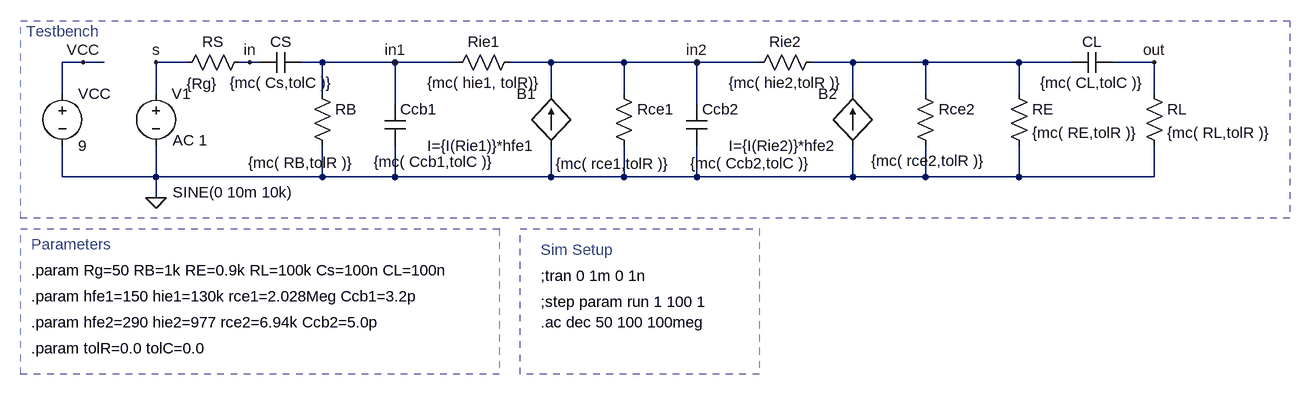
[diagram p0: schematic inc.asc]
inc.asc, the LTspice schematic file:
Version 4
SHEET 1 1348 680
WIRE -512 -224 -544 -224
WIRE -480 -224 -512 -224
WIRE -352 -224 -400 -224
WIRE -256 -224 -272 -224
WIRE -240 -224 -256 -224
WIRE -144 -224 -176 -224
WIRE -32 -224 -144 -224
WIRE 64 -224 -32 -224
WIRE 208 -224 144 -224
WIRE 320 -224 208 -224
WIRE 432 -224 320 -224
WIRE 528 -224 432 -224
WIRE 672 -224 608 -224
WIRE 784 -224 672 -224
WIRE 928 -224 784 -224
WIRE 1008 -224 928 -224
WIRE 1136 -224 1072 -224
WIRE -544 -176 -544 -224
WIRE -400 -176 -400 -224
WIRE -144 -176 -144 -224
WIRE 208 -176 208 -224
WIRE 320 -176 320 -224
WIRE 672 -176 672 -224
WIRE 784 -176 784 -224
WIRE 928 -176 928 -224
WIRE 1136 -176 1136 -224
WIRE -32 -160 -32 -224
WIRE 432 -160 432 -224
WIRE -544 -48 -544 -96
WIRE -400 -48 -400 -96
WIRE -400 -48 -544 -48
WIRE -144 -48 -144 -96
WIRE -144 -48 -400 -48
WIRE -32 -48 -32 -96
WIRE -32 -48 -144 -48
WIRE 208 -48 208 -96
WIRE 208 -48 -32 -48
WIRE 320 -48 320 -96
WIRE 320 -48 208 -48
WIRE 432 -48 432 -96
WIRE 432 -48 320 -48
WIRE 672 -48 672 -96
WIRE 672 -48 432 -48
WIRE 784 -48 784 -96
WIRE 784 -48 672 -48
WIRE 928 -48 928 -96
WIRE 928 -48 784 -48
WIRE 1136 -48 1136 -96
WIRE 1136 -48 928 -48
WIRE -400 -16 -400 -48
FLAG -400 -16 0
FLAG 1136 -224 out
FLAG -256 -224 in
FLAG 432 -224 in2
FLAG -400 -224 s
FLAG -32 -224 in1
FLAG -512 -224 VCC
SYMBOL voltage -400 -192 R0
WINDOW 3 26 168 Left 2
WINDOW 123 26 88 Left 2
WINDOW 39 0 0 Left 0
SYMATTR Value SINE(0 10m 10k)
SYMATTR Value2 AC 1
SYMATTR InstName V1
SYMBOL voltage -544 -192 R0
WINDOW 123 0 0 Left 0
WINDOW 39 0 0 Left 0
SYMATTR InstName VCC
SYMATTR Value 9
SYMBOL res -368 -208 R270
WINDOW 0 32 56 VTop 2
WINDOW 3 -1 39 VBottom 2
SYMATTR InstName RS
SYMATTR Value {Rg}
SYMBOL res -160 -192 R0
WINDOW 3 -98 122 Left 2
SYMATTR Value {mc( RB,tolR )}
SYMATTR InstName RB
SYMBOL res 48 -208 R270
WINDOW 0 32 56 VTop 2
WINDOW 3 0 56 VBottom 2
SYMATTR InstName Rie1
SYMATTR Value {mc( hie1, tolR)}
SYMBOL res 304 -192 R0
WINDOW 3 -89 124 Left 2
SYMATTR Value {mc( rce1,tolR )}
SYMATTR InstName Rce1
SYMBOL cap -240 -208 R270
WINDOW 0 32 32 VTop 2
WINDOW 3 0 32 VBottom 2
SYMATTR InstName CS
SYMATTR Value {mc( Cs,tolC )}
SYMBOL cap -48 -160 R0
WINDOW 3 -17 89 Left 2
SYMATTR Value {mc( Ccb1,tolC )}
SYMATTR InstName Ccb1
SYMBOL res 512 -208 R270
WINDOW 0 32 56 VTop 2
WINDOW 3 0 56 VBottom 2
SYMATTR InstName Rie2
SYMATTR Value {mc( hie2,tolR )}
SYMBOL res 768 -192 R0
WINDOW 3 -68 119 Left 2
SYMATTR Value {mc( rce2,tolR )}
SYMATTR InstName Rce2
SYMBOL cap 416 -160 R0
WINDOW 3 6 91 Left 2
SYMATTR Value {mc( Ccb2,tolC )}
SYMATTR InstName Ccb2
SYMBOL res 912 -192 R0
SYMATTR InstName RE
SYMATTR Value {mc( RE,tolR )}
SYMBOL res 1120 -192 R0
SYMATTR InstName RL
SYMATTR Value {mc( RL,tolR )}
SYMBOL cap 1008 -208 R270
WINDOW 0 32 32 VTop 2
WINDOW 3 0 32 VBottom 2
SYMATTR InstName CL
SYMATTR Value {mc( CL,tolC )}
SYMBOL bi 208 -96 R180
WINDOW 0 24 80 Left 2
WINDOW 3 24 0 Left 2
SYMATTR InstName B1
SYMATTR Value I={I(Rie1)}*hfe1
SYMBOL bi 672 -96 R180
WINDOW 0 24 80 Left 2
WINDOW 3 24 0 Left 2
SYMATTR InstName B2
SYMATTR Value I={I(Rie2)}*hfe2
TEXT -600 -272 Left 2 ;Testbench
TEXT -592 56 Left 2 ;Parameters
TEXT -592 96 Left 2 !.param Rg=50 RB=1k RE=0.9k RL=100k Cs=100n CL=100n
TEXT -592 136 Left 2 !.param hfe1=150 hie1=130k rce1=2.028Meg Ccb1=3.2p
TEXT -592 176 Left 2 !.param hfe2=290 hie2=977 rce2=6.94k Ccb2=5.0p
TEXT -592 216 Left 2 !.param tolR=0.0 tolC=0.0
TEXT 192 64 Left 2 ;Sim Setup
TEXT 192 104 Left 2 !;tran 0 1m 0 1n
TEXT 192 144 Left 2 !;step param run 1 100 1
TEXT 192 176 Left 2 !.ac dec 50 100 100meg
RECTANGLE Normal 128 256 -608 32 2
RECTANGLE Normal 528 256 160 32 2
RECTANGLE Normal 1344 16 -608 -288 2

The netlist it stands for:
* inc.asc
V1 s 0 SINE(0 10m 10k) AC 1
VCC VCC 0 9
RS s in {Rg}
RB in1 0 {mc( RB,tolR )}
Rie1 in1 in2 {mc( hie1, tolR)}
Rce1 in2 0 {mc( rce1,tolR )}
CS in in1 {mc( Cs,tolC )}
Ccb1 in1 0 {mc( Ccb1,tolC )}
Rie2 in2 N001 {mc( hie2,tolR )}
Rce2 N001 0 {mc( rce2,tolR )}
Ccb2 in2 0 {mc( Ccb2,tolC )}
RE N001 0 {mc( RE,tolR )}
RL out 0 {mc( RL,tolR )}
CL N001 out {mc( CL,tolC )}
B1 0 in2 I={I(Rie1)}*hfe1
B2 0 N001 I={I(Rie2)}*hfe2
* Testbench
* Parameters
.param Rg=50 RB=1k RE=0.9k RL=100k Cs=100n CL=100n
.param hfe1=150 hie1=130k rce1=2.028Meg Ccb1=3.2p
.param hfe2=290 hie2=977 rce2=6.94k Ccb2=5.0p
.param tolR=0.0 tolC=0.0
* Sim Setup
;tran 0 1m 0 1n
;step param run 1 100 1
.ac dec 50 100 100meg
.backanno
.end